# Altium project MB1272.PrjPcb (part 4 of 5)

## Sheet Ethernet.SchDoc: Ethernet
size A4; Date: 01-DEC-2013; CompanyName: STMicroelectronics; Organization: Microcontrollers Division; Address1: 12, Rue Jules HOROWITZ; Address2: 38019 Grenoble; Address3: FRANCE; DocumentNumber: MB1272; Revision: A-01; SheetNumber: 12; SheetTotal: 15; Project: STM32MP15-DISCO PI
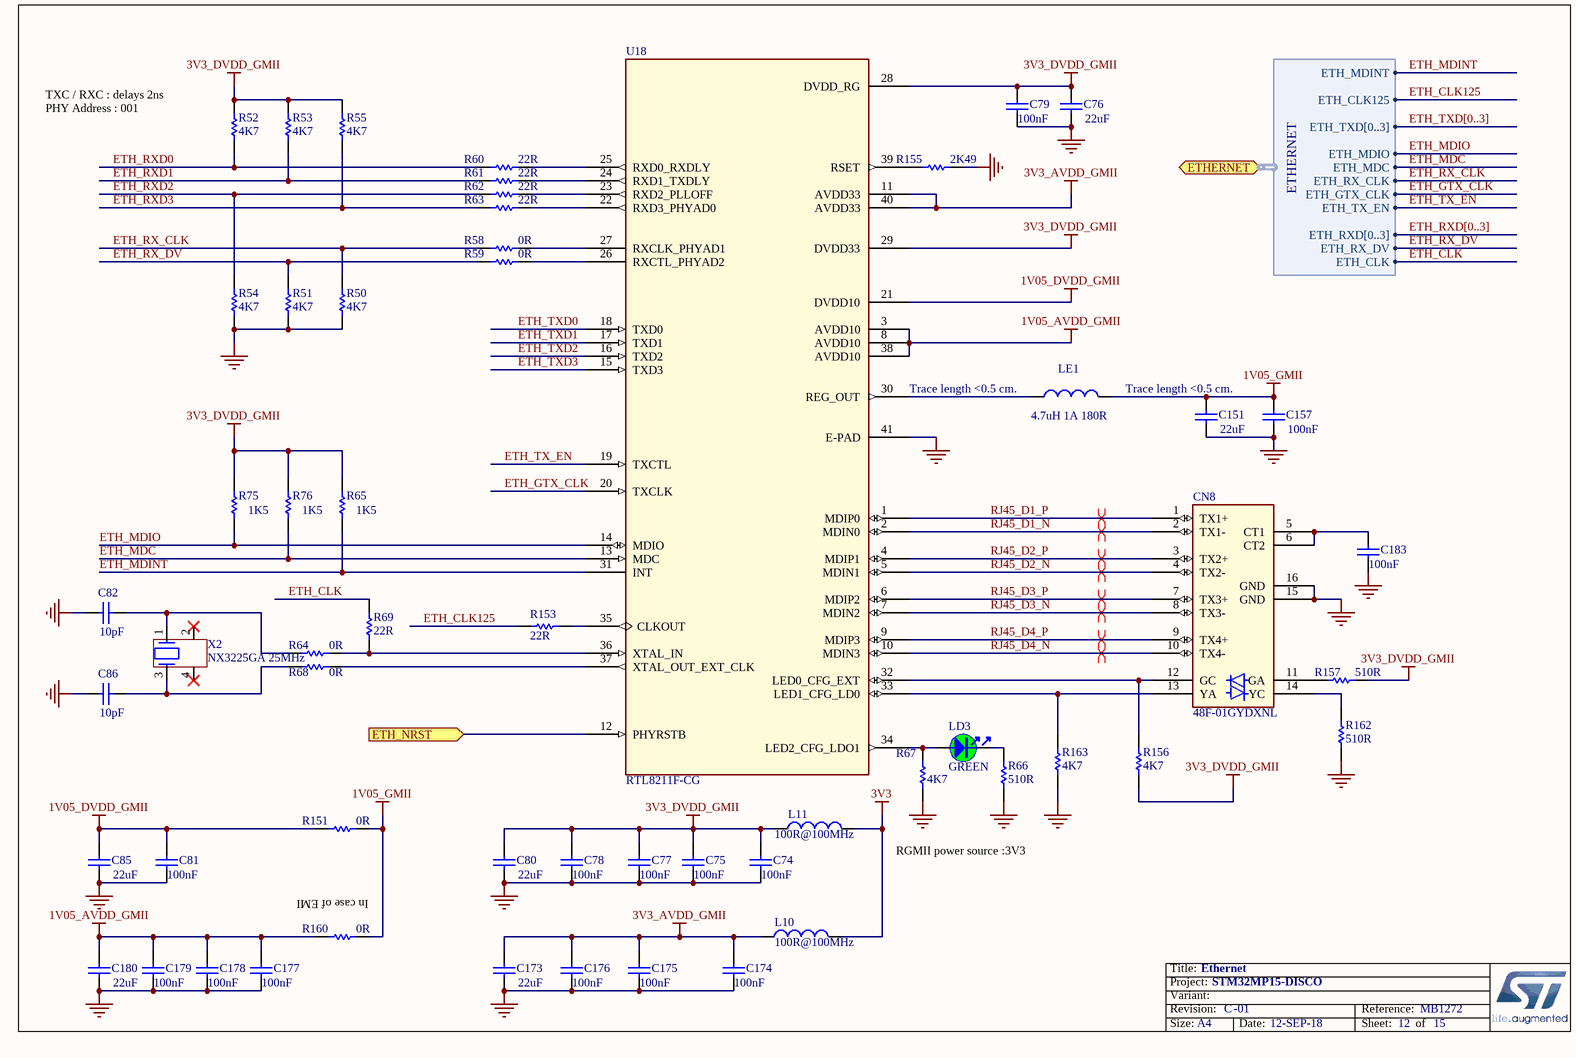
[diagram p10: Ethernet.SchDoc]

### Parts
C74  value 100nF  [C0402]
C75  value 100nF  [C0402]
C76  value 22uF  [C0603]
C77  value 100nF  [C0402]
C78  value 100nF  [C0402]
C79  value 100nF  [C0402]
C80  value 22uF  [C0603]
C81  value 100nF  [C0402]
C82  value 10pF  [C0402]
C85  value 22uF  [C0603]
C86  value 10pF  [C0402]
C151  value 22uF  [C0603]
C157  value 100nF  [C0402]
C173  value 22uF  [C0603]
C174  value 100nF  [C0402]
C175  value 100nF  [C0402]
C176  value 100nF  [C0402]
C177  value 100nF  [C0402]
C178  value 100nF  [C0402]
C179  value 100nF  [C0402]
C180  value 22uF  [C0603]
C183  value 100nF  [C0402]
CN8  value 48F-01GYDXNL  [CON_RJ45_YD_48F-01GYDXNL_LED-P]  (hidden comment: ​New part for use of led pulled down on pin 13/14 , schematic more lisible.)
L10  value 100R@100MHz  [FIL_0603_H0P65]
L11  value 100R@100MHz  [FIL_0603_H0P65]
LD3  value GREEN  [LED_0603_GREEN]
LE1  value 4.7uH 1A 180R  [L1210_LQH]
R50  value 4K7  [R0402]
R51  value 4K7  [R0402]
R52  value 4K7  [R0402]
R53  value 4K7  [R0402]
R54  value 4K7  [R0402]
R55  value 4K7  [R0402]
R58  value 0R  [R0402]
R59  value 0R  [R0402]
R60  value 22R  [R0402]
R61  value 22R  [R0402]
R62  value 22R  [R0402]
R63  value 22R  [R0402]
R64  value 0R  [R0402]
R65  value 1K5  [R0402]
R66  value 510R  [R0402]
R67  value 4K7  [R0402]
R68  value 0R  [R0402]
R69  value 22R  [R0402]
R75  value 1K5  [R0402]
R76  value 1K5  [R0402]
R151  value 0R  [R0603]
R153  value 22R  [R0402]
R155  value 2K49  [R0402]
R156  value 4K7  [R0402]
R157  value 510R  [R0402]
R160  value 0R  [R0603]
R162  value 510R  [R0402]
R163  value 4K7  [R0402]
U18  RTL8211F-CG  [ICC_QFN40-EPAD_5X5_P040]
X2  value NX3225GA 25MHz  [CRY_NX3225HA_4P]  (hidden comment: XTAL_4_PINS)

### Ports
ETH_NRST (in), ETHERNET (harness ETHERNET)

### Harnesses
ETHERNET: ETH_MDINT, ETH_CLK125, ETH_TXD[0..3], ETH_MDIO, ETH_MDC, ETH_RX_CLK, ETH_GTX_CLK, ETH_TX_EN, ETH_RXD[0..3], ETH_RX_DV, ETH_CLK

### Nets
1V05_AVDD_GMII: C177.2 C178.2 C179.2 C180.2 R160.1 U18.3(AVDD10) U18.8(AVDD10) U18.38(AVDD10)
1V05_DVDD_GMII: C81.2 C85.2 R151.1 U18.21(DVDD10)
1V05_GMII: C151.2 C157.2 LE1.2 R151.2 R160.2
3V3: L10.2 L11.2
3V3_AVDD_GMII: C173.2 C174.2 C175.2 C176.2 L10.1 U18.11(AVDD33) U18.40(AVDD33)
3V3_DVDD_GMII: C74.2 C75.2 C76.1 C77.2 C78.2 C79.2 C80.2 L11.1 R52.2 R53.2 R55.2 R65.2 R75.2 R76.2 R156.1 R157.2 U18.28(DVDD_RG) U18.29(DVDD33)
GND: C74.1 C75.1 C76.2 C77.1 C78.1 C79.1 C80.1 C81.1 C82.1 C85.1 C86.1 C151.1 C157.1 C173.1 C174.1 C175.1 C176.1 C177.1 C178.1 C179.1 C180.1 C183.1 CN8.15(GND) CN8.16(GND) R50.1 R51.1 R54.1 R66.1 R67.1 R155.2 R162.1 R163.1 U18.41(E-PAD)
ETH_CLK: R69.2 ; port ETHERNET.ETH_CLK
ETH_CLK125: R153.1 ; port ETHERNET.ETH_CLK125
ETH_GTX_CLK: U18.20(TXCLK) ; port ETHERNET.ETH_GTX_CLK
ETH_MDC: R76.1 U18.13(MDC) ; port ETHERNET.ETH_MDC
ETH_MDINT: R65.1 U18.31(INT) ; port ETHERNET.ETH_MDINT
ETH_MDIO: R75.1 U18.14(MDIO) ; port ETHERNET.ETH_MDIO
ETH_NRST: U18.12(PHYRSTB) ; port ETH_NRST
ETH_RX_CLK: R50.2 R58.1 ; port ETHERNET.ETH_RX_CLK
ETH_RX_DV: R51.2 R59.1 ; port ETHERNET.ETH_RX_DV
ETH_RXD0: R52.1 R60.1
ETH_RXD1: R53.1 R61.1
ETH_RXD2: R54.2 R62.1
ETH_RXD3: R55.1 R63.1
ETH_TX_EN: U18.19(TXCTL) ; port ETHERNET.ETH_TX_EN
ETH_TXD0: U18.18(TXD0)
ETH_TXD1: U18.17(TXD1)
ETH_TXD2: U18.16(TXD2)
ETH_TXD3: U18.15(TXD3)
RJ45_D1_N: CN8.2(TX1-) U18.2(MDIN0)
RJ45_D1_P: CN8.1(TX1+) U18.1(MDIP0)
RJ45_D2_N: CN8.4(TX2-) U18.5(MDIN1)
RJ45_D2_P: CN8.3(TX2+) U18.4(MDIP1)
RJ45_D3_N: CN8.8(TX3-) U18.7(MDIN2)
RJ45_D3_P: CN8.7(TX3+) U18.6(MDIP2)
RJ45_D4_N: CN8.10(TX4-) U18.10(MDIN3)
RJ45_D4_P: CN8.9(TX4+) U18.9(MDIP3)
NetC82_2: C82.2 R64.1 X2.1
NetC86_2: C86.2 R68.1 X2.3
NetC183_2: C183.2 CN8.5(CT1) CN8.6(CT2)
NetCN8_11: CN8.11(GA) R157.1
NetCN8_12: CN8.12(GC) R156.2 U18.32(LED0_CFG_EXT)
NetCN8_13: CN8.13(YA) R163.2 U18.33(LED1_CFG_LD0)
NetCN8_14: CN8.14(YC) R162.2
NetLD3_1: LD3.1 R67.2 U18.34(LED2_CFG_LDO1)
NetLD3_2: LD3.2 R66.2
NetLE1_1: LE1.1 U18.30(REG_OUT)
NetR58_2: R58.2 U18.27(RXCLK_PHYAD1)
NetR59_2: R59.2 U18.26(RXCTL_PHYAD2)
NetR60_2: R60.2 U18.25(RXD0_RXDLY)
NetR61_2: R61.2 U18.24(RXD1_TXDLY)
NetR62_2: R62.2 U18.23(RXD2_PLLOFF)
NetR63_2: R63.2 U18.22(RXD3_PHYAD0)
NetR64_2: R64.2 R69.1 U18.36(XTAL_IN)
NetR68_2: R68.2 U18.37(XTAL_OUT_EXT_CLK)
NetR153_2: R153.2 U18.35(CLKOUT)
NetR155_1: R155.1 U18.39(RSET)

Not connected (* = marked no-connect by the designer): X2 2* 4*

### Buses and harness runs
bus ETH_RXD[0..3]
bus ETH_TXD[0..3]

### Layout directives
differential pair: RJ45_D1_N, RJ45_D1_P, RJ45_D2_N, RJ45_D2_P, RJ45_D3_N, RJ45_D3_P, RJ45_D4_N, RJ45_D4_P

### Notes on the sheet
- (near R52) TXC / RXC : delays 2ns
  PHY Address : 001
- (near LE1) Trace length <0.5 cm.
- (near C151) Trace length <0.5 cm.
- (near R160) In case of EMI
- RGMII power source :3V3
- Title:
- Project:
- Size:
- Revision:
- Variant:
- A4
- -
- Date:
- Reference:
- Sheet:
- of

### Library data of the parts
C74 C75 C77-C79 C81 C157 C174-C179 C183 = MCD-00006: Capacitor,100nF,16V,X7R,10%,0402; Manufacturer_Part_Number: CC0402KRX7R7BB104; Manufacturer: YAGEO; Alternate_Manufacturer: MURATA; Alternate_Manufacturer_Part_Number: GCM155R71C104KA55D; Provided_By: SUBCO; Initial_Board_Reference: mb1274; Internal_Part_Number: MCD-00006; ComponentLink1Description: Datasheet; ECCN_US: n/a; ECCN_EU: n/a; Status: Released; Part_Type: Capacitor; Package: C0402; ComponentLink1URL: http://tunmcdsvn.tun.st.com/Component_Datasheet_Library/Trunk/Capacitors/Yageo_Multilayer_Capacitor_X7R_series_100pF_to_22uF
C76 C80 C85 C151 C173 C180 = MCD-00100: Capacitor,22uF,6V3,X5R,20%,0603; Manufacturer_Part_Number: GRM188R60J226MEA0J; Manufacturer: MURATA; ECCN_US: EAR99; ECCN_EU: NEC; Provided_By: SUBCO; Initial_Board_Reference: mb1262; Internal_Part_Number: MCD-00100; ComponentLink1Description: Datasheet; Status: Released; Part_Type: Capacitor; Package: C0603; ComponentLink1URL: http://tunmcdsvn.tun.st.com/Component_Datasheet_Library/Trunk/Capacitors/Murata_Capacitor_GR_series
C82 C86 = MCD-00015: Capacitor,10pF,50V,NPO,5%,0402; Manufacturer_Part_Number: CC0402JRNPO9BN100; Manufacturer: YAGEO; Provided_By: SUBCO; Initial_Board_Reference: mb1274; Internal_Part_Number: MCD-00015; ComponentLink1Description: Datasheet; ECCN_US: n/a; ECCN_EU: n/a; Status: Released; Part_Type: Capacitor; Package: C0402; ComponentLink1URL: http://tunmcdsvn.tun.st.com/Component_Datasheet_Library/Trunk/Capacitors/Yageo_Capacitor_NP0_16V-to-50V
CN8 = MCD-01129: Connector RJ45 with Gigabit magnetics and LED , led pull down; Manufacturer: YUAN DEAN SCIENTIFIC; Provided_By: SUBCO; Initial_Board_Reference: MB1272; Internal_Part_Number: MCD-01129; Manufacturer_Part_Number: 48F-01GYDXNL; ComponentLink1Description: Datasheet; Status: Footprint available; Part_Type: Connector; ECCN_US: n/a; ECCN_EU: n/a; ComponentLink1URL: http://tunmcdsvn.tun.st.com/Component_Datasheet_Library/Trunk/Connectors/YuanDean_RJ45_48Fseries/
L10 L11 = MCD-00094: Ferrite bead 100R 2A 0603; Manufacturer_Part_Number: BLM18EG101TN1; Manufacturer: MURATA; Part_Type: Inductor; ECCN_US: EAR99; ECCN_EU: NEC; Provided_By: SUBCO; Initial_Board_Reference: mb1262; Internal_Part_Number: MCD-00094; ComponentLink1Description: Datasheet; Status: Released; ComponentLink1URL: http://tunmcdsvn.tun.st.com/Component_Datasheet_Library/Trunk/Inductors/Murata_EMI_Filters_BLM
LD3 = MCD-00050: LED, Green, 0603; Manufacturer_Part_Number: 19-213SYGC/S530-E2/TR8; Manufacturer: EVERLIGHT; Part_Type: Display; ECCN_US: EAR99; ECCN_EU: NEC; Provided_By: SUBCO; Initial_Board_Reference: mb1274; Internal_Part_Number: MCD-00050; ComponentLink1Description: Datasheet; Status: Released; ComponentLink1URL: http://tunmcdsvn.tun.st.com/Component_Datasheet_Library/Trunk/Display/Everlight_SMD-LED-GREEN_19-213SYGC-S530-XX-TR8-v3.doc; Package: LED 0603
LE1 = MCD-00048: FIXED IND 4.7UH 1A 180 MOHM 30% SMD; Manufacturer_Part_Number: LQH32PN4R7NN0L; Manufacturer: MURATA; Provided_By: SUBCO; Initial_Board_Reference: mb1274; Internal_Part_Number: MCD-00048; ComponentLink1Description: Datasheet; ECCN_US: n/a; ECCN_EU: n/a; Status: Released; Part_Type: Inductor; ComponentLink1URL: http://tunmcdsvn.tun.st.com/Component_Datasheet_Library/Trunk/Inductors/Murata_Inductor_LQH32PN4R7NN0L
R50-R55 R67 R156 R163 = MCD-00065: Resistor,4K7,0402,1%,1/16W; Manufacturer_Part_Number: RC0402FR-074K7L; Manufacturer: YAGEO; Alternate_Manufacturer_Part_Number: RT0402FRE074K7L; Provided_By: SUBCO; Initial_Board_Reference: mb1274; Internal_Part_Number: MCD-00065; Alternate_Manufacturer: YAGEO; ComponentLink1Description: Datasheet; ECCN_US: n/a; ECCN_EU: n/a; Status: Released; Part_Type: Resistor; ComponentLink1URL: http://tunmcdsvn.tun.st.com/Component_Datasheet_Library/Trunk/Resistors/Yageo_Resistor_RC0402-series; Package: R0402
R58 R59 R64 R68 = MCD-00052: Resistor,0R,0402,5%,1/16W; Manufacturer_Part_Number: RC0402JR-070RL; Manufacturer: YAGEO; Provided_By: SUBCO; Initial_Board_Reference: mb1274; Internal_Part_Number: MCD-00052; ComponentLink1Description: Datasheet; ECCN_US: n/a; ECCN_EU: n/a; Status: Released; Part_Type: Resistor; ComponentLink1URL: http://tunmcdsvn.tun.st.com/Component_Datasheet_Library/Trunk/Resistors/Yageo_Resistor_RC0402-series; Package: R0402
R60-R63 R69 R153 = MCD-00189: Resistor,22R,0402,1%,1/16W; Manufacturer_Part_Number: RC0402FR-0722RL; Manufacturer: YAGEO; Provided_By: SUBCO; Internal_Part_Number: MCD-00189; ComponentLink1Description: Datasheet; ECCN_US: n/a; ECCN_EU: n/a; Status: Released; Part_Type: Resistor; ComponentLink1URL: http://tunmcdsvn.tun.st.com/Component_Datasheet_Library/Trunk/Resistors/Yageo_Resistor_RC0402-series; Package: R0402
R65 R75 R76 = MCD-00068: Resistor,1K5,0402,1%,1/16W; Manufacturer_Part_Number: RC0402FR-071K5L; Manufacturer: YAGEO; Provided_By: SUBCO; Initial_Board_Reference: mb1274; Internal_Part_Number: MCD-00068; ComponentLink1Description: Datasheet; ECCN_US: n/a; ECCN_EU: n/a; Status: Released; Part_Type: Resistor; ComponentLink1URL: http://tunmcdsvn.tun.st.com/Component_Datasheet_Library/Trunk/Resistors/Yageo_Resistor_RC0402-series; Package: R0402
R66 R157 R162 = MCD-00064: Resistor,510R,0402,1%,1/16W; Manufacturer_Part_Number: RC0402FR-07510RL; Manufacturer: YAGEO; Provided_By: SUBCO; Initial_Board_Reference: mb1274; Internal_Part_Number: MCD-00064; ComponentLink1Description: Datasheet; ECCN_US: n/a; ECCN_EU: n/a; Status: Released; Part_Type: Resistor; ComponentLink1URL: http://tunmcdsvn.tun.st.com/Component_Datasheet_Library/Trunk/Resistors/Yageo_Resistor_RC0402-series; Package: R0402
R151 R160 = MCD-00056: Resistor,0R,0603,5%,1/10W; Manufacturer_Part_Number: RC0603JR-070RL; Manufacturer: YAGEO; Provided_By: SUBCO; Initial_Board_Reference: mb1274; Internal_Part_Number: MCD-00056; ComponentLink1Description: Datasheet; ECCN_US: n/a; ECCN_EU: n/a; Status: Released; Part_Type: Resistor; ComponentLink1URL: http://tunmcdsvn.tun.st.com/Component_Datasheet_Library/Trunk/Resistors/Yageo_Resistor_RC0603-series; Package: R0603
R155 = MCD-00183: Resistor,2K49,0402,1%,1/16W; Manufacturer_Part_Number: RC0402FR-072K49L; Manufacturer: YAGEO; Provided_By: SUBCO; Internal_Part_Number: MCD-00183; ComponentLink1Description: Datasheet; ECCN_US: n/a; ECCN_EU: n/a; Status: Released; Part_Type: Resistor; ComponentLink1URL: http://tunmcdsvn.tun.st.com/Component_Datasheet_Library/Trunk/Resistors/Yageo_Resistor_RC0402-series; Package: R0402
U18 = MCD-01130: 10/100/1000M GIGABIT Ethernet Transceiver, QFN40 , SMPS version; Manufacturer: REALTEK; Part_Type: IC; Provided_By: SUBCO; Initial_Board_Reference: MB1272; Value: RTL8211F-CG; Internal_Part_Number: MCD-01130; Manufacturer_Part_Number: RTL8211F-CG; ComponentLink1Description: Datasheet; ComponentLink1URL: http://tunmcdsvn.tun.st.com/Component_Datasheet_Library/Trunk/IC/REALTEK_RTL8211F_RGMII_phy; Status: Checked; ECCN_US: n/a; ECCN_EU: n/a
X2 = MCD-01463: Crystal 25Mhz, 10pF, -+50PPM, SMD; Part_Type: Crystal_Osc; Manufacturer_Part_Number: NX3225GA 25MHz EXS00A-CG06750; Manufacturer: NDK; Provided_By: SUBCO; Initial_Board_Reference: MB1272B; Remark: footprint same as CRY_NX3225HA_4P; Internal_Part_Number: MCD-01463; Status: Footprint available; Package: 3225; ComponentLink1Description: Datasheet; ComponentLink1URL: http://tunmcdsvn.tun.st.com/Component_Datasheet_Library/Trunk/Crystal_Osc/NDK_NX3225GA 25Mhz  EXS00A-CG06750/NDK_NX3225GA 25MHz EXS00A-CG06750.pdf

## Sheet HDMI.SchDoc: HDMI
size A4; Date: 01-DEC-2013; CompanyName: STMicroelectronics; Organization: Microcontrollers Division; Address1: 12, Rue Jules HOROWITZ; Address2: 38019 Grenoble; Address3: FRANCE; DocumentNumber: MB1272; Revision: A-01; SheetNumber: 9; SheetTotal: 15; Project: STM32MP15-DISCO PI
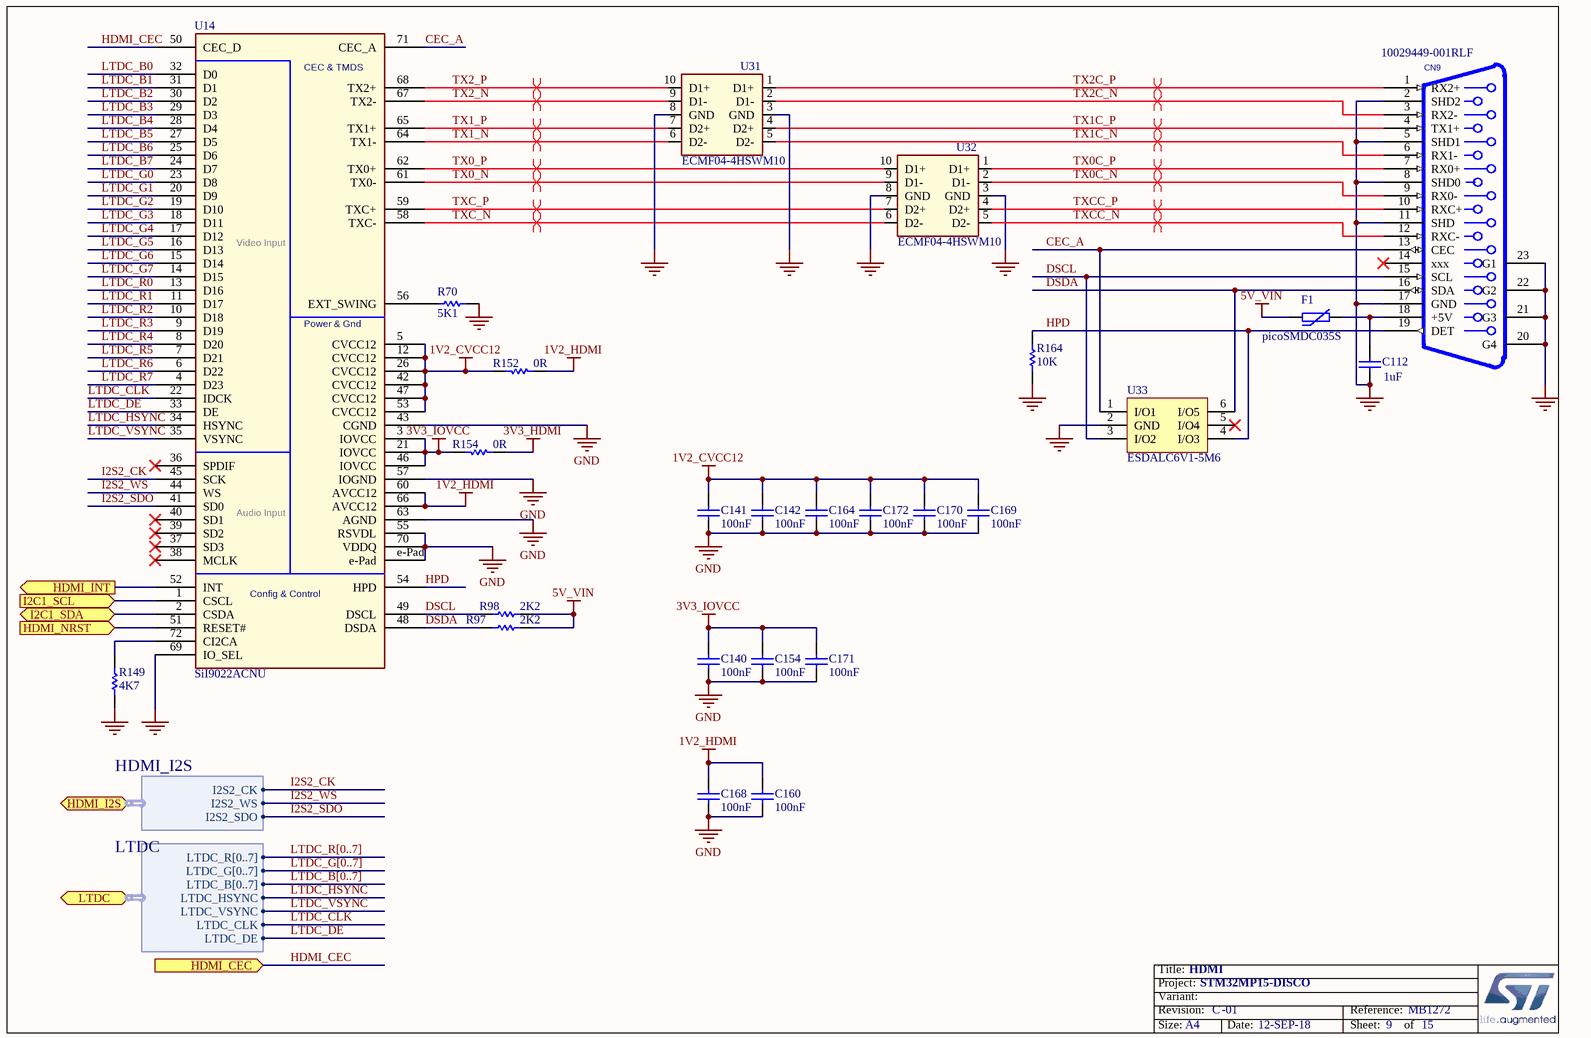
[diagram p11: HDMI.SchDoc]

### Parts
C112  value 1uF  [C0402]
C140  value 100nF  [C0402]
C141  value 100nF  [C0402]
C142  value 100nF  [C0402]
C154  value 100nF  [C0402]
C160  value 100nF  [C0402]
C164  value 100nF  [C0402]
C168  value 100nF  [C0402]
C169  value 100nF  [C0402]
C170  value 100nF  [C0402]
C171  value 100nF  [C0402]
C172  value 100nF  [C0402]
CN9  value 10029449-001RLF  [CON_HDMI_FCI-AMPHENOL_10029449-001RLF]
F1  value picoSMDC035S  [R0805]  (hidden comment: ​f)
R70  value 5K1  [R0402]
R97  value 2K2  [R0402]
R98  value 2K2  [R0402]
R149  value 4K7  [R0402]
R152  value 0R  [R0402]
R154  value 0R  [R0402]
R164  value 10K  [R0402]  (hidden comment: Resistor)
U14  value SiI9022ACNU  [ICC_QFN72-EPAD_10X10_P050]
U31  value ECMF04-4HSWM10  [ESD_UQFN-10L_2P60X1P35_P050]
U32  value ECMF04-4HSWM10  [ESD_UQFN-10L_2P60X1P35_P050]
U33  ESDALC6V1-5M6  [ESD_UQFN-6L_1P45X1_P050]

### Ports
HDMI_CEC (in), HDMI_I2S (harness HDMI_I2S), HDMI_INT (out), HDMI_NRST (in), I2C1_SCL (in), I2C1_SDA (bidir), LTDC (harness LTDC)

### Harnesses
LTDC: LTDC_R[0..7], LTDC_G[0..7], LTDC_B[0..7], LTDC_HSYNC, LTDC_VSYNC, LTDC_CLK, LTDC_DE
HDMI_I2S: I2S2_CK, I2S2_SDO, I2S2_WS

### Nets
1V2_CVCC12: C141.2 C142.2 C164.2 C169.2 C170.2 C172.2 R152.1 U14.5(CVCC12) U14.12(CVCC12) U14.26(CVCC12) U14.42(CVCC12) U14.47(CVCC12) U14.53(CVCC12)
1V2_HDMI: C160.2 C168.2 R152.2 U14.60(AVCC12) U14.66(AVCC12)
3V3_HDMI: R154.2
3V3_IOVCC: C140.2 C154.2 C171.2 R154.1 U14.3(IOVCC) U14.21(IOVCC) U14.46(IOVCC)
5V_VIN: F1.1 R97.2 R98.2
GND: C112.1 C140.1 C141.1 C142.1 C154.1 C160.1 C164.1 C168.1 C169.1 C170.1 C171.1 C172.1 CN9.2(SHD2) CN9.5(SHD1) CN9.8(SHD0) CN9.11(SHD) CN9.17(GND) CN9.20(G4) CN9.21(G3) CN9.22(G2) CN9.23(G1) R70.2 R149.1 R164.1 U14.43(CGND) U14.55(RSVDL) U14.57(IOGND) U14.63(AGND) U14.69(IO_SEL) U14.70(VDDQ) U14.e-Pad U31.3(GND) U31.8(GND) U32.3(GND) U32.8(GND) U33.2(GND)
CEC_A: CN9.13(CEC) U14.71(CEC_A) U33.1(I/O1)
DSCL: CN9.15(SCL) R98.1 U14.49(DSCL) U33.3(I/O2)
DSDA: CN9.16(SDA) R97.1 U14.48(DSDA) U33.6(I/O5)
HDMI_CEC: U14.50(CEC_D) ; port HDMI_CEC
HDMI_INT: U14.52(INT) ; port HDMI_INT
HDMI_NRST: U14.51(RESET#) ; port HDMI_NRST
HPD: CN9.19(DET) R164.2 U14.54(HPD) U33.4(I/O3)
I2C1_SCL: U14.1(CSCL) ; port I2C1_SCL
I2C1_SDA: U14.2(CSDA) ; port I2C1_SDA
I2S2_CK: U14.45(SCK) ; port HDMI_I2S.I2S2_CK
I2S2_SDO: U14.41(SD0) ; port HDMI_I2S.I2S2_SDO
I2S2_WS: U14.44(WS) ; port HDMI_I2S.I2S2_WS
LTDC_B0: U14.32(D0)
LTDC_B1: U14.31(D1)
LTDC_B2: U14.30(D2)
LTDC_B3: U14.29(D3)
LTDC_B4: U14.28(D4)
LTDC_B5: U14.27(D5)
LTDC_B6: U14.25(D6)
LTDC_B7: U14.24(D7)
LTDC_CLK: U14.22(IDCK) ; port LTDC.LTDC_CLK
LTDC_DE: U14.33(DE) ; port LTDC.LTDC_DE
LTDC_G0: U14.23(D8)
LTDC_G1: U14.20(D9)
LTDC_G2: U14.19(D10)
LTDC_G3: U14.18(D11)
LTDC_G4: U14.17(D12)
LTDC_G5: U14.16(D13)
LTDC_G6: U14.15(D14)
LTDC_G7: U14.14(D15)
LTDC_HSYNC: U14.34(HSYNC) ; port LTDC.LTDC_HSYNC
LTDC_R0: U14.13(D16)
LTDC_R1: U14.11(D17)
LTDC_R2: U14.10(D18)
LTDC_R3: U14.9(D19)
LTDC_R4: U14.8(D20)
LTDC_R5: U14.7(D21)
LTDC_R6: U14.6(D22)
LTDC_R7: U14.4(D23)
LTDC_VSYNC: U14.35(VSYNC) ; port LTDC.LTDC_VSYNC
TX0_N: U14.61(TX0-) U32.9(D1-)
TX0_P: U14.62(TX0+) U32.10(D1+)
TX0C_N: CN9.9(RX0-) U32.2(D1-)
TX0C_P: CN9.7(RX0+) U32.1(D1+)
TX1_N: U14.64(TX1-) U31.6(D2-)
TX1_P: U14.65(TX1+) U31.7(D2+)
TX1C_N: CN9.6(RX1-) U31.5(D2-)
TX1C_P: CN9.4(TX1+) U31.4(D2+)
TX2_N: U14.67(TX2-) U31.9(D1-)
TX2_P: U14.68(TX2+) U31.10(D1+)
TX2C_N: CN9.3(RX2-) U31.2(D1-)
TX2C_P: CN9.1(RX2+) U31.1(D1+)
TXC_N: U14.58(TXC-) U32.6(D2-)
TXC_P: U14.59(TXC+) U32.7(D2+)
TXCC_N: CN9.12(RXC-) U32.5(D2-)
TXCC_P: CN9.10(RXC+) U32.4(D2+)
NetC112_2: C112.2 CN9.18(+5V) F1.2
NetR70_1: R70.1 U14.56(EXT_SWING)
NetR149_2: R149.2 U14.72(CI2CA)

Not connected (* = marked no-connect by the designer): CN9 14(xxx)*; U14 36(SPDIF)* 37(SD3)* 38(MCLK)* 39(SD2)* 40(SD1)*; U33 5(I/O4)*

### Buses and harness runs
bus LTDC_B[0..7]
bus LTDC_G[0..7]
bus LTDC_R[0..7]

### Layout directives
differential pair: TX0_N, TX0_P, TX0C_N, TX0C_P, TX1_N, TX1_P, TX1C_N, TX1C_P, TX2_N, TX2_P, TX2C_N, TX2C_P, TXC_N, TXC_P, TXCC_N, TXCC_P

### Notes on the sheet
- Title:
- Project:
- Size:
- Revision:
- Variant:
- A4
- -
- Date:
- Reference:
- Sheet:
- of
- (in symbol MCD-00267) CEC & TMDS; Video Input; Power & Gnd; Audio Input; Config & Control

### Library data of the parts
C112 = MCD-00095: Capacitor,1uF,6V3,X5R,10%,0402; Manufacturer_Part_Number: GRM155R61E105KA12; Manufacturer: MURATA; Alternate_Manufacturer_Part_Number: GRM155R60J105KE19; ECCN_US: EAR99; ECCN_EU: NEC; Provided_By: SUBCO; Initial_Board_Reference: mb1262; Internal_Part_Number: MCD-00095; ComponentLink1Description: Datasheet; Status: Released; Part_Type: Capacitor; Package: C0402; ComponentLink1URL: http://tunmcdsvn.tun.st.com/Component_Datasheet_Library/Trunk/Capacitors/Murata_Capacitor_GR_series; Alternate_Manufacturer: MURATA
C140-C142 C154 C160 C164 C168-C172 = MCD-00006: as C74 on sheet Ethernet; Internal_Part_Number: MCD-00006; ComponentLink1Description: Datasheet; ECCN_US: n/a; ECCN_EU: n/a; Status: Released; Part_Type: Capacitor; Package: C0402; ComponentLink1URL: http://tunmcdsvn.tun.st.com/Component_Datasheet_Library/Trunk/Capacitors/Yageo_Multilayer_Capacitor_X7R_series_100pF_to_22uF
CN9 = MCD-00307: HDMI Receptacle Type A 19pins standard Connector; Manufacturer: FCI; Provided_By: SUBCO; Initial_Board_Reference: MB1272; Internal_Part_Number: MCD-00307; Manufacturer_Part_Number: 10029449-001RLF; ComponentLink1Description: Datasheet; ComponentLink1URL: http://tunmcdsvn.tun.st.com/Component_Datasheet_Library/Trunk/Connectors/AMPHENOL_FCI _HDMI_10029449-001RLF; ECCN_US: n/a; ECCN_EU: n/a; Status: Checked; Part_Type: Connector
F1 = MCD-01133: Surface mount resettable polyswitch fuse.I hold=0.35A and I trigger=0.75A; Part_Type: Misc; Manufacturer: TE CONNECTIVITY; Provided_By: SUBCO; Initial_Board_Reference: MB1272; Internal_Part_Number: MCD-01133; Status: Footprint available; Manufacturer_Part_Number: picoSMDC035S; Package: 0805; ComponentLink1Description: Datasheet; ComponentLink1URL: http://tunmcdsvn.tun.st.com/Component_Datasheet_Library/Trunk/Misc/TECONNECTIVITY_PTC_FUSE_PicoSMDCO35S; ECCN_US: n/a; ECCN_EU: n/a
R70 = MCD-00333: Resistor,5K1,0402,1%,1/16W; Manufacturer_Part_Number: RC0402FR-075K1L; Manufacturer: YAGEO; Provided_By: SUBCO; Initial_Board_Reference: mb1272; Internal_Part_Number: MCD-00333; ComponentLink1Description: Datasheet; ECCN_US: n/a; ECCN_EU: n/a; Status: Released; Part_Type: Resistor; ComponentLink1URL: http://tunmcdsvn.tun.st.com/Component_Datasheet_Library/Trunk/Resistors/Yageo_Resistor_RC0402-series; Package: R0402
R97 R98 = MCD-00057: Resistor,2K2,0402,1%,1/16W; Manufacturer_Part_Number: RC0402FR-072K2L; Manufacturer: YAGEO; Provided_By: SUBCO; Initial_Board_Reference: mb1274; Internal_Part_Number: MCD-00057; ComponentLink1Description: Datasheet; ECCN_US: n/a; ECCN_EU: n/a; Status: Released; Part_Type: Resistor; ComponentLink1URL: http://tunmcdsvn.tun.st.com/Component_Datasheet_Library/Trunk/Resistors/Yageo_Resistor_RC0402-series; Package: R0402
R149 = MCD-00065: as R50 on sheet Ethernet; Internal_Part_Number: MCD-00065; Alternate_Manufacturer: YAGEO; ComponentLink1Description: Datasheet; ECCN_US: n/a; ECCN_EU: n/a; Status: Released; Part_Type: Resistor; ComponentLink1URL: http://tunmcdsvn.tun.st.com/Component_Datasheet_Library/Trunk/Resistors/Yageo_Resistor_RC0402-series; Package: R0402
R152 R154 = MCD-00052: as R58 on sheet Ethernet; Internal_Part_Number: MCD-00052; Status: Released; Part_Type: Resistor; Package: R0402; ComponentLink1Description: Datasheet; ComponentLink1URL: http://tunmcdsvn.tun.st.com/Component_Datasheet_Library/Trunk/Resistors/Yageo_Resistor_RC0402-series; ECCN_US: n/a; ECCN_EU: n/a
R164 = MCD-00053: Resistor,10K,0402,1%,1/16W; Manufacturer_Part_Number: RC0402FR-0710KL; Manufacturer: YAGEO; Provided_By: SUBCO; Initial_Board_Reference: MB1274; Internal_Part_Number: MCD-00053; Status: Released; Part_Type: Resistor; Package: R0402; ComponentLink1Description: Datasheet; ComponentLink1URL: http://tunmcdsvn.tun.st.com/Component_Datasheet_Library/Trunk/Resistors/Yageo_Resistor_RC0402-series; ECCN_US: n/a; ECCN_EU: n/a
U14 = MCD-00267: HDMI Transmitter, 72-pin 10 × 10 mm QFN; Part_Type: IC; Manufacturer: LATTICE; Provided_By: SUBCO; Initial_Board_Reference: MB1272; Internal_Part_Number: MCD-00267; Status: Checked; Manufacturer_Part_Number: SiI9022ACNU; ComponentLink1Description: Datasheet; ComponentLink1URL: http://tunmcdsvn.tun.st.com/Component_Datasheet_Library/Trunk/IC/LATTICE_SiI9022ACNU_HDMI_Transmitter
U31 U32 = MCD-00297: ESD protection & Common Filter High Speed serial Interfaces; Part_Type: Diode; Manufacturer: STMICROELECTRONICS; BMS_Part_Number: 9151127; Provided_By: SUBCO with ST control; Initial_Board_Reference: MB1272; Internal_Part_Number: MCD-00297; Status: Checked; Manufacturer_Part_Number: ECMF04-4HSWM10; ComponentLink1Description: Datasheet; ComponentLink1URL: http://tunmcdsvn.tun.st.com/Component_Datasheet_Library/Trunk/Diodes/STM_ESD_ECMF04-4HSWM10; ECCN_US: n/a; ECCN_EU: n/a
U33 = MCD-01457: ESD protection , 5 lines; Part_Type: Diode; Manufacturer: STMICROELECTRONICS; Provided_By: SUBCO; Initial_Board_Reference: MB1272B; Internal_Part_Number: MCD-01457; Value: ESDALC6V1-5M6; Status: Footprint available; Manufacturer_Part_Number: ESDALC6V1-5M6; Package: QFN; ComponentLink1Description: Datasheet; ComponentLink1URL: http://tunmcdsvn.tun.st.com/Component_Datasheet_Library/Trunk/Diodes/STM_ESD_ESDALC6V1-5M6/STM_ESD_ESDALC6V1-5M6.pdf

## Sheet USB_Host_Hub&TypeC_DRP.SchDoc: USB_Host_Hub&TypeC_DRP
size A3; DocumentNumber: MB1272; Revision: A-01; SheetNumber: 6; SheetTotal: 15; Project: STM32MP15-DISCO PI
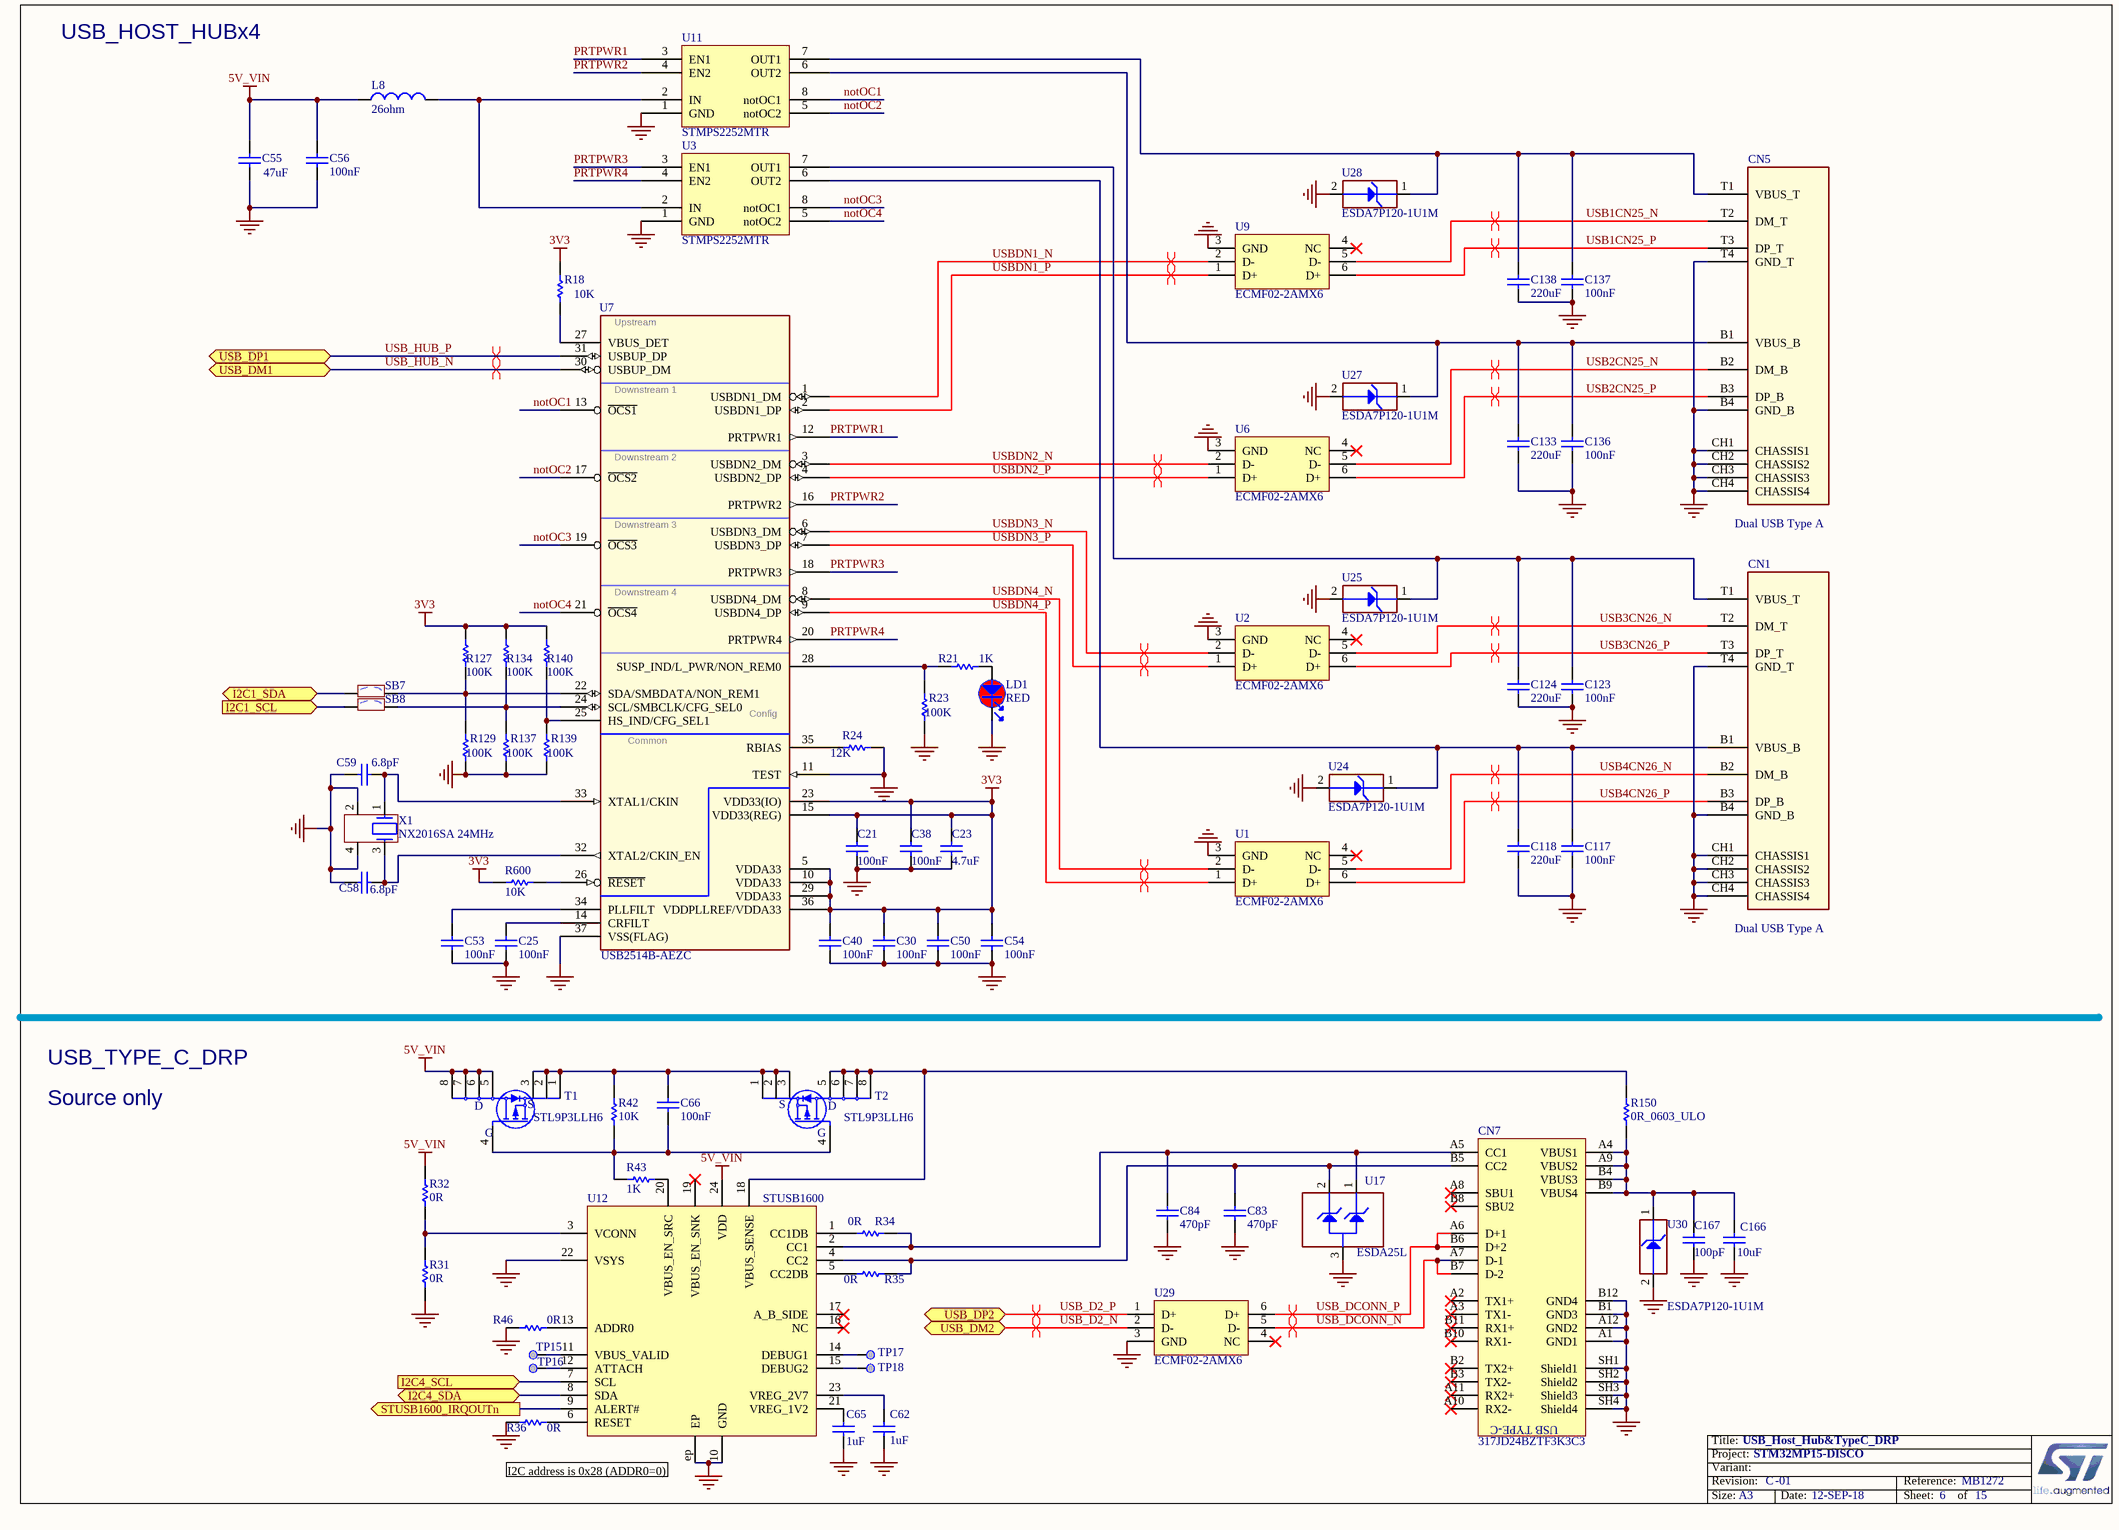
[diagram p12: USB_Host_Hub&TypeC_DRP.SchDoc]

### Parts
C21  value 100nF  [C0402]  (hidden comment: Capacitor)
C23  value 4.7uF  [C0402]  (hidden comment: Capacitor)
C25  value 100nF  [C0402]  (hidden comment: Capacitor)
C30  value 100nF  [C0402]  (hidden comment: Capacitor)
C38  value 100nF  [C0402]  (hidden comment: Capacitor)
C40  value 100nF  [C0402]  (hidden comment: Capacitor)
C50  value 100nF  [C0402]  (hidden comment: Capacitor)
C53  value 100nF  [C0402]  (hidden comment: Capacitor)
C54  value 100nF  [C0402]  (hidden comment: Capacitor)
C55  value 47uF  [C0805]  (hidden comment: Capacitor)
C56  value 100nF  [C0402]  (hidden comment: Capacitor)
C58  value 6.8pF  [C0402]  (hidden comment: Capacitor)
C59  value 6.8pF  [C0402]  (hidden comment: Capacitor)
C62  value 1uF  [C0402]  (hidden comment: Capacitor)
C65  value 1uF  [C0402]  (hidden comment: Capacitor)
C66  value 100nF  [C0402]  (hidden comment: Capacitor)
C83  value 470pF  [C0402]  (hidden comment: Capacitor)
C84  value 470pF  [C0402]  (hidden comment: Capacitor)
C117  value 100nF  [C0402]  (hidden comment: Capacitor)
C118  value 220uF  [C1206_H1P6]  (hidden comment: Capacitor)
C123  value 100nF  [C0402]  (hidden comment: Capacitor)
C124  value 220uF  [C1206_H1P6]  (hidden comment: Capacitor)
C133  value 220uF  [C1206_H1P6]  (hidden comment: Capacitor)
C136  value 100nF  [C0402]  (hidden comment: Capacitor)
C137  value 100nF  [C0402]  (hidden comment: Capacitor)
C138  value 220uF  [C1206_H1P6]  (hidden comment: Capacitor)
C166  value 10uF  [C0805]  (hidden comment: Capacitor)
C167  value 100pF  [C0402]  (hidden comment: Capacitor)
CN1  value Dual USB Type A  [CON_DUAL-USB-TYPE-A_CONEXCON_5600-3081]  (hidden comment: USB_DUAL_TYPEA_5600-3081)
CN5  value Dual USB Type A  [CON_DUAL-USB-TYPE-A_CONEXCON_5600-3081]  (hidden comment: USB_DUAL_TYPEA_5600-3081)
CN7  value 317JD24BZTF3K3C3  [CON_USB-TYPEC_COXOC_317JD24BZTF3K3C3]
L8  value 26ohm  [FIL_0603_H0P65]  (hidden comment: BEAD)
LD1  value RED  [LED_0603_RED]  (hidden comment: LED_red)
R18  value 10K  [R0402]  (hidden comment: Resistor)
R21  value 1K  [R0402]  (hidden comment: Resistor)
R23  value 100K  [R0402]  (hidden comment: Resistor)
R24  value 12K  [R0402]  (hidden comment: Resistor)
R31  value 0R  [R0402]  (hidden comment: Resistor)
R32  value 0R  [R0402]  (hidden comment: Resistor)
R34  value 0R  [R0402]  (hidden comment: Resistor)
R35  value 0R  [R0402]  (hidden comment: Resistor)
R36  value 0R  [R0402]  (hidden comment: Resistor)
R42  value 10K  [R0402]  (hidden comment: Resistor)
R43  value 1K  [R0402]  (hidden comment: Resistor)
R46  value 0R  [R0402]  (hidden comment: Resistor)
R127  value 100K  [R0402]  (hidden comment: Resistor)
R129  value 100K  [R0402]  (hidden comment: Resistor)
R134  value 100K  [R0402]  (hidden comment: Resistor)
R137  value 100K  [R0402]  (hidden comment: Resistor)
R139  value 100K  [R0402]  (hidden comment: Resistor)
R140  value 100K  [R0402]  (hidden comment: Resistor)
R150  value 0R_0603_ULO  [R0603]  (hidden comment: Resistor)
R600  value 10K  [R0402]  (hidden comment: Resistor)
SB7  SB_OFF  [SOLDER-BRIDGE_R0603-0R]  (value not drawn)
SB8  SB_OFF  [SOLDER-BRIDGE_R0603-0R]  (value not drawn)
T1  value STL9P3LLH6  [MOS_POWERFLAT_3P3X3P3_P065]
T2  value STL9P3LLH6  [MOS_POWERFLAT_3P3X3P3_P065]
TP15  Test Point  [TP_SMD_1MM]  (value not drawn)  (no BOM)
TP16  Test Point  [TP_SMD_1MM]  (value not drawn)  (no BOM)
TP17  Test Point  [TP_SMD_1MM]  (value not drawn)  (no BOM)
TP18  Test Point  [TP_SMD_1MM]  (value not drawn)  (no BOM)
U1  value ECMF02-2AMX6  [ESD_QFN-6L_1P7X1P5_P050]  (hidden comment: ​)
U2  value ECMF02-2AMX6  [ESD_QFN-6L_1P7X1P5_P050]  (hidden comment: ​)
U3  STMPS2252MTR  [ICC_SO8_5X4_P127]
U6  value ECMF02-2AMX6  [ESD_QFN-6L_1P7X1P5_P050]  (hidden comment: ​)
U7  USB2514B-AEZC  [ICC_QFN36-EPAD_6X6_P050]
U9  value ECMF02-2AMX6  [ESD_QFN-6L_1P7X1P5_P050]  (hidden comment: ​)
U11  STMPS2252MTR  [ICC_SO8_5X4_P127]
U12  value STUSB1600  [ICC_QFN24-EPAD_4X4_P050]  (hidden comment: ​Symbol correction needed ?)
U17  value ESDA25L  [ESD_SOT23]  (hidden comment: New schematic symbol : correction 2 diodes instead of one)
U24  value ESDA7P120-1U1M  [ESD_QFN1610_2N_1K_2A]  (hidden comment: ​Footprint needed DFN105P160X60-2N)
U25  value ESDA7P120-1U1M  [ESD_QFN1610_2N_1K_2A]  (hidden comment: ​Footprint needed DFN105P160X60-2N)
U27  value ESDA7P120-1U1M  [ESD_QFN1610_2N_1K_2A]  (hidden comment: ​Footprint needed DFN105P160X60-2N)
U28  value ESDA7P120-1U1M  [ESD_QFN1610_2N_1K_2A]  (hidden comment: ​Footprint needed DFN105P160X60-2N)
U29  value ECMF02-2AMX6  [ESD_QFN-6L_1P7X1P5_P050]  (hidden comment: ​)
U30  value ESDA7P120-1U1M  [ESD_QFN1610_2N_1K_2A]  (hidden comment: ​Footprint needed DFN105P160X60-2N)
X1  value NX2016SA 24MHz  [CRY_NX2016SA_4P]  (hidden comment: XTAL_4_PINS)

### Ports
I2C1_SCL (in), I2C1_SDA (bidir), I2C4_SCL (in), I2C4_SDA (bidir), STUSB1600_IRQOUTn (out), USB_DM1 (bidir), USB_DM2 (bidir), USB_DP1 (bidir), USB_DP2 (bidir)

### Nets
3V3: C21.2 C23.2 C30.2 C38.2 C40.2 C50.2 C54.2 R18.2 R127.2 R134.2 R140.2 R600.1 U7.5(VDDA33) U7.10(VDDA33) U7.15(VDD33(REG)) U7.23(VDD33(IO)) U7.29(VDDA33) U7.36(VDDPLLREF/VDDA33)
5V_VIN: C55.2 C56.2 L8.1 R32.2 T1.5(D) T1.6(D) T1.7(D) T1.8(D) U12.24(VDD)
GND: C21.1 C23.1 C25.1 C30.1 C38.1 C40.1 C50.1 C53.1 C54.1 C55.1 C56.1 C58.1 C59.1 C62.1 C65.1 C83.1 C84.1 C117.1 C118.1 C123.1 C124.1 C133.1 C136.1 C137.1 C138.1 C166.1 C167.1 CN1.B4(GND_B) CN1.CH1(CHASSIS1) CN1.CH2(CHASSIS2) CN1.CH3(CHASSIS3) CN1.CH4(CHASSIS4) CN1.T4(GND_T) CN5.B4(GND_B) CN5.CH1(CHASSIS1) CN5.CH2(CHASSIS2) CN5.CH3(CHASSIS3) CN5.CH4(CHASSIS4) CN5.T4(GND_T) CN7.A1(GND1) CN7.A12(GND2) CN7.B1(GND3) CN7.B12(GND4) CN7.SH1(Shield1) CN7.SH2(Shield2) CN7.SH3(Shield3) CN7.SH4(Shield4) LD1.2 R23.1 R24.1 R31.1 R36.1 R46.1 R129.1 R137.1 R139.1 U1.3(GND) U2.3(GND) U3.1(GND) U6.3(GND) U7.11(TEST) U7.37(VSS(FLAG)) U9.3(GND) U11.1(GND) U12.10(GND) U12.22(VSYS) U12.ep(EP) U17.3(GND) U24.2(GND) U25.2(GND) U27.2(GND) U28.2(GND) U29.3(GND) U30.2(GND) X1.2 X1.4
I2C1_SCL: SB8.1 ; port I2C1_SCL
I2C1_SDA: SB7.1 ; port I2C1_SDA
I2C4_SCL: U12.7(SCL) ; port I2C4_SCL
I2C4_SDA: U12.8(SDA) ; port I2C4_SDA
notOC1: U7.13(~{OCS1}) U11.8(notOC1)
notOC2: U7.17(~{OCS2}) U11.5(notOC2)
notOC3: U3.8(notOC1) U7.19(~{OCS3})
notOC4: U3.5(notOC2) U7.21(~{OCS4})
PRTPWR1: U7.12(PRTPWR1) U11.3(EN1)
PRTPWR2: U7.16(PRTPWR2) U11.4(EN2)
PRTPWR3: U3.3(EN1) U7.18(PRTPWR3)
PRTPWR4: U3.4(EN2) U7.20(PRTPWR4)
STUSB1600_IRQOUTn: U12.9(ALERT#) ; port STUSB1600_IRQOUTn
USB1CN25_N: CN5.T2(DM_T) U9.5(D-)
USB1CN25_P: CN5.T3(DP_T) U9.6(D+)
USB2CN25_N: CN5.B2(DM_B) U6.5(D-)
USB2CN25_P: CN5.B3(DP_B) U6.6(D+)
USB3CN26_N: CN1.T2(DM_T) U2.5(D-)
USB3CN26_P: CN1.T3(DP_T) U2.6(D+)
USB4CN26_N: CN1.B2(DM_B) U1.5(D-)
USB4CN26_P: CN1.B3(DP_B) U1.6(D+)
USB_D2_N: U29.2(D-) ; port USB_DM2  [project net USB2_N]
USB_D2_P: U29.1(D+) ; port USB_DP2  [project net USB2_P]
USB_DCONN_N: CN7.A7(D-1) CN7.B7(D-2) U29.5(D-)
USB_DCONN_P: CN7.A6(D+1) CN7.B6(D+2) U29.6(D+)
USB_HUB_N: U7.30(USBUP_DM) ; port USB_DM1  [project net USB1_N]
USB_HUB_P: U7.31(USBUP_DP) ; port USB_DP1  [project net USB1_P]
USBDN1_N: U7.1(USBDN1_DM) U9.2(D-)
USBDN1_P: U7.2(USBDN1_DP) U9.1(D+)
USBDN2_N: U6.2(D-) U7.3(USBDN2_DM)
USBDN2_P: U6.1(D+) U7.4(USBDN2_DP)
USBDN3_N: U2.2(D-) U7.6(USBDN3_DM)
USBDN3_P: U2.1(D+) U7.7(USBDN3_DP)
USBDN4_N: U1.2(D-) U7.8(USBDN4_DM)
USBDN4_P: U1.1(D+) U7.9(USBDN4_DP)
NetC25_2: C25.2 U7.14(CRFILT)
NetC53_2: C53.2 U7.34(PLLFILT)
NetC58_2: C58.2 U7.32(XTAL2/CKIN_EN) X1.3
NetC59_2: C59.2 U7.33(XTAL1/CKIN) X1.1
NetC62_2: C62.2 U12.23(VREG_2V7)
NetC65_2: C65.2 U12.21(VREG_1V2)
NetC66_1: C66.1 R42.1 R43.1 T1.4(G) T2.4(G)
NetC66_2: C66.2 R42.2 T1.1(S) T1.2(S) T1.3(S) T2.1(S) T2.2(S) T2.3(S)
NetC83_2: C83.2 CN7.B5(CC2) R35.2 U12.4(CC2) U17.2(IO2)
NetC84_2: C84.2 CN7.A5(CC1) R34.2 U12.2(CC1) U17.1(IO1)
NetC117_2: C117.2 C118.2 CN1.B1(VBUS_B) U3.6(OUT2) U24.1(IO1)
NetC123_2: C123.2 C124.2 CN1.T1(VBUS_T) U3.7(OUT1) U25.1(IO1)
NetC133_2: C133.2 C136.2 CN5.B1(VBUS_B) U11.6(OUT2) U27.1(IO1)
NetC137_2: C137.2 C138.2 CN5.T1(VBUS_T) U11.7(OUT1) U28.1(IO1)
NetC166_2: C166.2 C167.2 CN7.A4(VBUS1) CN7.A9(VBUS2) CN7.B4(VBUS3) CN7.B9(VBUS4) R150.1 U30.1(IO1)
NetL8_2: L8.2 U3.2(IN) U11.2(IN)
NetLD1_1: LD1.1 R21.1
NetR18_1: R18.1 U7.27(VBUS_DET)
NetR21_2: R21.2 R23.2 U7.28(SUSP_IND/L_PWR/NON_REM0)
NetR24_2: R24.2 U7.35(RBIAS)
NetR31_2: R31.2 R32.1 U12.3(VCONN)
NetR34_1: R34.1 U12.1(CC1DB)
NetR35_1: R35.1 U12.5(CC2DB)
NetR36_2: R36.2 U12.6(RESET)
NetR43_2: R43.2 U12.20(VBUS_EN_SRC)
NetR46_2: R46.2 U12.13(ADDR0)
NetR127_1: R127.1 R129.2 SB7.2 U7.22(SDA/SMBDATA/NON_REM1)
NetR134_1: R134.1 R137.2 SB8.2 U7.24(SCL/SMBCLK/CFG_SEL0)
NetR139_2: R139.2 R140.1 U7.25(HS_IND/CFG_SEL1)
NetR150_2: R150.2 T2.5(D) T2.6(D) T2.7(D) T2.8(D) U12.18(VBUS_SENSE)
NetR600_2: R600.2 U7.26(~{RESET})
NetTP15_1: TP15.1 U12.11(VBUS_VALID)
NetTP16_1: TP16.1 U12.12(ATTACH)
NetTP17_1: TP17.1 U12.14(DEBUG1)
NetTP18_1: TP18.1 U12.15(DEBUG2)

Not connected (* = marked no-connect by the designer): CN7 A2(TX1+)* A3(TX1-)* A8(SBU1)* A10(RX2-)* A11(RX2+)* B2(TX2+)* B3(TX2-)* B8(SBU2)* B10(RX1-)* B11(RX1+)*; U1 4(NC)*; U2 4(NC)*; U6 4(NC)*; U9 4(NC)*; U12 16(NC)* 17(A_B_SIDE)* 19(VBUS_EN_SNK)*; U29 4(NC)*

### Layout directives
differential pair: USB1_N, USB1_P, USB1CN25_N, USB1CN25_P, USB2_N, USB2_P, USB2CN25_N, USB2CN25_P, USB3CN26_N, USB3CN26_P, USB4CN26_N, USB4CN26_P, USB_DCONN_N, USB_DCONN_P, USBDN1_N, USBDN1_P, USBDN2_N, USBDN2_P, USBDN3_N, USBDN3_P, USBDN4_N, USBDN4_P

### Notes on the sheet
- USB_HOST_HUBx4
- USB_TYPE_C_DRP
- Source only
- I2C address is 0x28 (ADDR0=0)
- Title:
- Project:
- Size:
- Revision:
- Variant:
- A3
- -
- Date:
- Reference:
- Sheet:
- of
- (in symbol MCD-00145) Upstream; Downstream 1; Downstream 2; Downstream 3; Downstream 4; Config; Common
- (in symbol MCD-01108) USB TYPE-C

### Library data of the parts
C21 C25 C30 C38 C40 C50 C53 C54 C56 C66 C117 C123 C136 C137 = MCD-00102: Capacitor, MLCC, 100nF, 16V, X7R, 10%, 0402, T=0,5mm; Manufacturer_Part_Number: CC0402KRX7R7BB104; Manufacturer: YAGEO; Alternate_Manufacturer: MURATA; Alternate_Manufacturer_Part_Number: GCM155R71C104KA55D; Provided_By: SUBCO; Initial_Board_Reference: MB1262; Internal_Part_Number: MCD-00102; ComponentLink1Description: Datasheet; Status: Released; Part_Type: Capacitor; Package: C0402; ECCN_US: n/a; ECCN_EU: n/a; ComponentLink1URL: http://tunmcdsvn.tun.st.com/Component_Datasheet_Library/Trunk/Capacitors/Yageo_Multilayer_Capacitor_X7R_series_100pF_to_22uF
C23 = MCD-01356: Capacitor, MLCC, 4.7uF, 6V3, X5R, 20%, 0402, T=0,5mm; Manufacturer_Part_Number: GRM155R60J475ME47; Manufacturer: MURATA; Provided_By: SUBCO; Internal_Part_Number: MCD-01356; Status: Released; Part_Type: Capacitor; Package: C0402; ComponentLink1Description: Datasheet; ComponentLink1URL: http://tunmcdsvn.tun.st.com/Component_Datasheet_Library/Trunk/Capacitors/Murata_Capacitor_GR_series
C55 = MCD-00204: Capacitor, MLCC, 47uF, 10V, X5R, 20%, 0805, T=1,25mm; Manufacturer_Part_Number: GRM21BR61A476ME15K; Manufacturer: MURATA; Provided_By: SUBCO; ECCN_US: EAR99; ECCN_EU: NEC; Internal_Part_Number: MCD-00204; ComponentLink1Description: Datasheet; Status: Footprint available; Part_Type: Capacitor; Package: C0805; ComponentLink1URL: http://tunmcdsvn.tun.st.com/Component_Datasheet_Library/Trunk/Capacitors/Murata_Capacitor_GR_series
C58 C59 = MCD-00674: Capacitor, MLCC, 6.8pF, 50V, NPO, +-0.25pF, 0402, T=0.5mm; Manufacturer_Part_Number: CC0402CRNPO9BN6R8; Manufacturer: YAGEO; Provided_By: SUBCO; Internal_Part_Number: MCD-00674; Status: Released; Part_Type: Capacitor; Package: C0402; ComponentLink1Description: Datasheet; ComponentLink1URL: http://tunmcdsvn.tun.st.com/Component_Datasheet_Library/Trunk/Capacitors/Yageo_Capacitor_NP0_16V-to-50V
C62 C65 = MCD-00095: Capacitor, MLCC, 1uF, 6V3, X5R, 10%, 0402, T=0,5mm; Manufacturer_Part_Number: GRM155R61E105KA12; Manufacturer: MURATA; Alternate_Manufacturer_Part_Number: GRM155R60J105KE19; ECCN_US: EAR99; ECCN_EU: NEC; Provided_By: SUBCO; Initial_Board_Reference: MB1262; Internal_Part_Number: MCD-00095; Status: Released; Part_Type: Capacitor; Package: C0402; ComponentLink1Description: Datasheet; ComponentLink1URL: http://tunmcdsvn.tun.st.com/Component_Datasheet_Library/Trunk/Capacitors/Murata_Capacitor_GR_series; Alternate_Manufacturer: MURATA
C83 C84 = MCD-00724: Capacitor, MLCC, 470pF, 50V, NPO, 5%, 0402, T=0,5mm; Manufacturer_Part_Number: CC0402JRNPO9BN471; Manufacturer: YAGEO; Provided_By: SUBCO; Initial_Board_Reference: MB1271; Internal_Part_Number: MCD-00724; Status: Released; Part_Type: Capacitor; Package: C0402; ComponentLink1Description: Datasheet; ComponentLink1URL: http://tunmcdsvn.tun.st.com/Component_Datasheet_Library/Trunk/Capacitors/Yageo_Capacitor_NP0_16V-to-50V; ECCN_US: n/a; ECCN_EU: n/a
C118 C124 C133 C138 = MCD-00104: Capacitor, MLCC, 220uF, 6V3, X5R, 20%, 1206, T=1,6mm; Manufacturer_Part_Number: GRM31CR60J227ME11; Manufacturer: MURATA; ECCN_US: EAR99; ECCN_EU: NEC; Provided_By: SUBCO; Initial_Board_Reference: MB1262; Internal_Part_Number: MCD-00104; Status: Released; Part_Type: Capacitor; Package: C1206; ComponentLink1Description: Datasheet; ComponentLink1URL: http://tunmcdsvn.tun.st.com/Component_Datasheet_Library/Trunk/Capacitors/Murata_Capacitor_GR_series
C166 = MCD-00014: Capacitor, MLCC, 10uF, 25V, X5R, 10%, 0805, T=0,85mm; Manufacturer_Part_Number: CC0805KRX5R8BB106; Manufacturer: YAGEO; Provided_By: SUBCO; Initial_Board_Reference: MB1274; Internal_Part_Number: MCD-00014; Status: Released; Part_Type: Capacitor; Package: C0805; ComponentLink1Description: Datasheet; ComponentLink1URL: http://tunmcdsvn.tun.st.com/Component_Datasheet_Library/Trunk/Capacitors/Yageo_Multilayer_capacitor_X5R_series_100pF_to_100uF; ECCN_US: n/a; ECCN_EU: n/a
C167 = MCD-00205: Capacitor, MLCC, 100pF, 50V, NPO, 5%, 0402, T=0,5mm; Manufacturer_Part_Number: CC0402JRNPO9BN101; Manufacturer: YAGEO; Provided_By: SUBCO; Internal_Part_Number: MCD-00205; Status: Released; Part_Type: Capacitor; Package: C0402; ComponentLink1Description: Datasheet; ComponentLink1URL: http://tunmcdsvn.tun.st.com/Component_Datasheet_Library/Trunk/Capacitors/Yageo_Capacitor_NP0_16V-to-50V
CN1 CN5 = MCD-00109: USB-Receptacle,Dual-Type-A, RA, TH, Height 15.5mm; Manufacturer: CONEXCON; Part_Type: Connector; Provided_By: SUBCO; Initial_Board_Reference: MB1262; Internal_Part_Number: MCD-00109; Manufacturer_Part_Number: 5600-3081; ComponentLink1Description: Datasheet; Status: Released; ECCN_US: n/a; ECCN_EU: n/a; ComponentLink1URL: http://tunmcdsvn.tun.st.com/Component_Datasheet_Library/Trunk/Connectors/Conexcon_Dual_USB_TypeA_5600-3081
CN7 = MCD-01108: USB tyce C certified receptacle for 1.6mm pcb height; Part_Type: Connector; Manufacturer: CHANT SINCERE (COXOC); ECCN_US: NA; Provided_By: SUBCO; Initial_Board_Reference: MB1272; Internal_Part_Number: MCD-01108; Status: Released; Manufacturer_Part_Number: 317JD24BZTF3K3C3; ComponentLink1Description: Datasheet; ComponentLink1URL: http://tunmcdsvn.tun.st.com/Component_Datasheet_Library/Trunk/Connectors/Chant%20sincere_usb%20type%20C%20connector%20317JD24BZTF3K3C3; ECCN_EU: NA
L8 = MCD-00305: Bead,26R at 100Mhz,6A,0603; Manufacturer_Part_Number: BLM18KG260TN1; Manufacturer: MURATA; Part_Type: Inductor; Provided_By: SUBCO; Initial_Board_Reference: MB1272; Internal_Part_Number: MCD-00305; ComponentLink1Description: Datasheet; ECCN_US: n/a; ECCN_EU: n/a; Status: Checked; ComponentLink1URL: http://tunmcdsvn.tun.st.com/Component_Datasheet_Library/Trunk/Inductors/Murata_EMI_Filters_BLM
LD1 = MCD-00049: LED, Red, 0603; Manufacturer_Part_Number: 19-213-R6C-AP1Q2B/3T; Manufacturer: EVERLIGHT; Part_Type: Display; ECCN_US: EAR99; ECCN_EU: NEC; Provided_By: SUBCO; Initial_Board_Reference: MB1274; Internal_Part_Number: MCD-00049; ComponentLink1Description: Datasheet; Status: Released; ComponentLink1URL: http://tunmcdsvn.tun.st.com/Component_Datasheet_Library/Trunk/Display/Everlight_SMD-LED-RED_19-213-R6C-AP1Q2B-3T-V3.doc; Package: LED 0603
R18 R42 R600 = MCD-00053: Resistor,10K,0402,1%,1/16W; Manufacturer_Part_Number: RC0402FR-0710KL; Manufacturer: YAGEO; Provided_By: SUBCO; Initial_Board_Reference: MB1274; Internal_Part_Number: MCD-00053; ComponentLink1Description: Datasheet; ECCN_US: n/a; ECCN_EU: n/a; Status: Released; Part_Type: Resistor; ComponentLink1URL: http://tunmcdsvn.tun.st.com/Component_Datasheet_Library/Trunk/Resistors/Yageo_Resistor_RC0402-series; Package: R0402
R21 R43 = MCD-00061: Resistor,1K,0402,1%,1/16W; Manufacturer_Part_Number: RC0402FR-071KL; Manufacturer: YAGEO; Provided_By: SUBCO; Initial_Board_Reference: MB1274; Internal_Part_Number: MCD-00061; ComponentLink1Description: Datasheet; ECCN_US: n/a; ECCN_EU: n/a; Status: Released; Part_Type: Resistor; ComponentLink1URL: http://tunmcdsvn.tun.st.com/Component_Datasheet_Library/Trunk/Resistors/Yageo_Resistor_RC0402-series; Package: R0402
R23 R127 R129 R134 R137 R139 R140 = MCD-00059: Resistor,100K,0402,1%,1/16W; Manufacturer_Part_Number: RC0402FR-07100KL; Manufacturer: YAGEO; Alternate_Manufacturer_Part_Number: RT0402FRE07100KL; Provided_By: SUBCO; Initial_Board_Reference: MB1274; Internal_Part_Number: MCD-00059; Alternate_Manufacturer: YAGEO; ComponentLink1Description: Datasheet; ECCN_US: n/a; ECCN_EU: n/a; Status: Released; Part_Type: Resistor; ComponentLink1URL: http://tunmcdsvn.tun.st.com/Component_Datasheet_Library/Trunk/Resistors/Yageo_Resistor_RC0402-series; Package: R0402
R24 = MCD-00187: Resistor,12K,0402,1%,1/16W; Manufacturer_Part_Number: RC0402FR-0712KL; Manufacturer: YAGEO; Provided_By: SUBCO; Internal_Part_Number: MCD-00187; ComponentLink1Description: Datasheet; ECCN_US: n/a; ECCN_EU: n/a; Status: Released; Part_Type: Resistor; ComponentLink1URL: http://tunmcdsvn.tun.st.com/Component_Datasheet_Library/Trunk/Resistors/Yageo_Resistor_RC0402-series; Package: R0402
R31 R32 R34-R36 R46 = MCD-00052: Resistor,0R,0402,5%,1/16W; Manufacturer_Part_Number: RC0402JR-070RL; Manufacturer: YAGEO; Provided_By: SUBCO; Initial_Board_Reference: MB1274; Internal_Part_Number: MCD-00052; ComponentLink1Description: Datasheet; ECCN_US: n/a; ECCN_EU: n/a; Status: Released; Part_Type: Resistor; ComponentLink1URL: http://tunmcdsvn.tun.st.com/Component_Datasheet_Library/Trunk/Resistors/Yageo_Resistor_RC0402-series; Package: R0402
R150 = MCD-00181: Resistor,0R,0603,ULO; Manufacturer_Part_Number: PMR03EZPJ000; Manufacturer: ROHM; Provided_By: SUBCO; Internal_Part_Number: MCD-00181; Status: Released; Part_Type: Resistor; Package: R0603; ComponentLink1Description: Datasheet; ComponentLink1URL: http://tunmcdsvn.tun.st.com/Component_Datasheet_Library/Trunk/Resistors/ROHM_ULtra_low_Ohmic_Resistor_PMR10EZPJ000; ECCN_US: n/a; ECCN_EU: n/a
SB7 SB8 = MCD-00072: Solder Bridge OFF; Part_Type: Mechanical; Manufacturer: YAGEO; Manufacturer_Part_Number: RC0603JR-070RL; Provided_By: SUBCO; Initial_Board_Reference: MB1274; Internal_Part_Number: MCD-00072; ECCN_US: n/a; ECCN_EU: n/a; Status: Released; ComponentLink1Description: Datasheet; ComponentLink1URL: http://tunmcdsvn.tun.st.com/Component_Datasheet_Library/Trunk/Resistors/Yageo_Resistor_RC0603-series; Package: SB0603
T1 T2 = MCD-01126: Power Mosfet, P-channel,VDS -30V,RDS 12mohm typ,ID -9A; Part_Type: IC; Manufacturer: STMICROELECTRONICS; ECCN_US: EAR99; ECCN_EU: NEC; Provided_By: SUBCO with ST control; Initial_Board_Reference: MB1272; Internal_Part_Number: MCD-01126; Status: Checked; Manufacturer_Part_Number: STL9P3LLH6; Package: PowerFLAT 3.3x3.3; ComponentLink1Description: Datasheet; ComponentLink1URL: http://tunmcdsvn.tun.st.com/Component_Datasheet_Library/Trunk/IC/STM_POWER_MOSFET_P_STL9P3LLH6
TP15-TP18 = MCD-00074: Test Point 1mm; Part_Type: Mechanical; Initial_Board_Reference: MB1274; Internal_Part_Number: MCD-00074; Status: Released; ECCN_US: n/a; ECCN_EU: n/a; Provided_By: n/a; Manufacturer_Part_Number: n/a; Manufacturer: n/a; ComponentLink1Description: Datasheet; ComponentLink1URL: http://na
U1 U2 U6 U9 U29 = MCD-00649: Common mode filter with ESD protection for USB 2.0 interface; Part_Type: Diode; Manufacturer: STMICROELECTRONICS; BMS_Part_Number: 9151138; ECCN_US: EAR99; ECCN_EU: NEC; Provided_By: SUBCO with ST control; Initial_Board_Reference: MB1248; Internal_Part_Number: MCD-00649; Status: Released; Manufacturer_Part_Number: ECMF02-2AMX6; ComponentLink1Description: Datasheet; ComponentLink1URL: http://tunmcdsvn.tun.st.com/Component_Datasheet_Library/Trunk/Diodes/STM_ESD_ECMF02-2AMX6
U3 U11 = MCD-00123: IC,Dual-Channel-Power-Switch,500mA,100mR,SO8; Manufacturer: STMICROELECTRONICS; BMS_Part_Number: 9159012; ECCN_US: EAR99; ECCN_EU: NEC; Provided_By: SUBCO with ST control; Initial_Board_Reference: MB1262; Value: STMPS2252MTR; Internal_Part_Number: MCD-00123; Manufacturer_Part_Number: STMPS2252MTR; ComponentLink1Description: Datasheet; Status: Released; Part_Type: IC; ComponentLink1URL: http://tunmcdsvn.tun.st.com/Component_Datasheet_Library/Trunk/IC/STM_PWR_switch_STMPS2252MTR
U7 = MCD-00145: USB HUB 2,0 Controller; Manufacturer: MICROCHIP; Part_Type: IC; ECCN_US: EAR99; ECCN_EU: NEC; Provided_By: SUBCO; Initial_Board_Reference: MB1262; Value: USB2514B-AEZC; Internal_Part_Number: MCD-00145; Manufacturer_Part_Number: USB2514B-AEZC; ComponentLink1Description: Datasheet; Status: Released; ComponentLink1URL: http://tunmcdsvn.tun.st.com/Component_Datasheet_Library/Trunk/IC/Microchip_HS Hub Controller_USB2514B-AEZC
U12 = MCD-00676: USB Type-C controller with VCONN switch; Part_Type: IC; Manufacturer_Part_Number: STUSB1600AQTR; Manufacturer: STMICROELECTRONICS; BMS_Part_Number: 9158053; Provided_By: SUBCO with ST control; Initial_Board_Reference: MB1272; Internal_Part_Number: MCD-00676; Status: Footprint available; ComponentLink1Description: Datasheet; ComponentLink1URL: http://tunmcdsvn.tun.st.com/Component_Datasheet_Library/Trunk/IC/STM_usbtypeC_controller_STUSB1600; ECCN_US: n/a; ECCN_EU: n/a
U17 = MCD-01125: DUAL TRANSIL ARRAY FOR ESD PROTECTION; Part_Type: Diode; Manufacturer: STMICROELECTRONICS; BMS_Part_Number: 9151131; ECCN_US: EAR99; ECCN_EU: NEC; Provided_By: SUBCO with ST control; Initial_Board_Reference: MB1272; Internal_Part_Number: MCD-01125; Status: Checked; Manufacturer_Part_Number: ESDA25L; Package: ESD_SOT23; ComponentLink1Description: Datasheet; ComponentLink1URL: http://tunmcdsvn.tun.st.com/Component_Datasheet_Library/Trunk/Diodes/STM_ESD_ESDA25L
U24 U25 U27 U28 U30 = MCD-01026: High power transient voltage suppressor; Part_Type: Diode; Manufacturer: STMICROELECTRONICS; BMS_Part_Number: 9179046; ECCN_US: EAR99; ECCN_EU: NEC; Provided_By: SUBCO with ST control; Initial_Board_Reference: MB1378; Internal_Part_Number: MCD-01026; Status: Released; Manufacturer_Part_Number: ESDA7P120-1U1M; Package: QFN1610; ComponentLink1Description: Datasheet; ComponentLink1URL: http://tunmcdsvn.tun.st.com/Component_Datasheet_Library/Trunk/Diodes/STM_ESD_ESDA7P120-1U1M
X1 = MCD-01036: Crystal 24MHz, 6pF, +-20ppm, 80ohms max, SMD; Part_Type: Crystal_Osc; Manufacturer_Part_Number: NX2016SA 24MHz EXS00A-CS10820; Manufacturer: NDK; BMS_Part_Number: 9157045; Provided_By: SUBCO; Internal_Part_Number: MCD-01036; Status: Checked; Package: (2016) 2.0 x 1.6 x 0.45 mm; ComponentLink1Description: Datasheet; ComponentLink1URL: http://tunmcdsvn.tun.st.com/Component_Datasheet_Library/Trunk/Crystal_Osc/NDK_NX2016SA 24MHz EXS00A-CS10820 (EXS10B-27366B)